# Altium schematic sheet LPCB218 - CHARGER INTERFACE.SchDoc
size A3; Address1: Factory 10; Address2: 9-13 Dingley Avenue, Dandeong, VICTORIA 3175, AUSTRALIA; DocumentNumber: 2; Revision: 1; SheetNumber: 2; SheetTotal: 14; Lockie__PCB_SUB_ASSEMBLY: Charger IF; Lockie__PCB_ASSEMBLY: Command Node; Lockie__LDL: LPCB218; Lockie__PCB_DESCRIPTION: Command Node
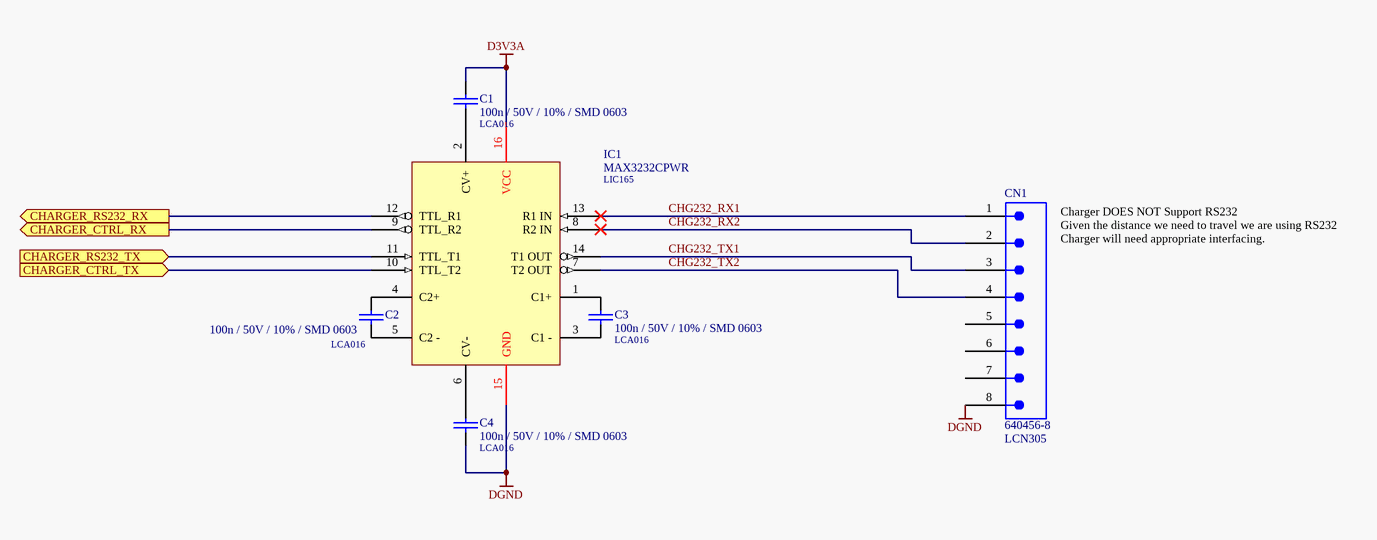
[diagram p0: LPCB218 - CHARGER INTERFACE.SchDoc]

## Parts
C1  100n / 50V / 10% / SMD 0603  LDL_NUMBER: LCA016  [LFP011__CC1608-0603-IPC7351_B]
C2  100n / 50V / 10% / SMD 0603  LDL_NUMBER: LCA016  [LFP011__CC1608-0603-IPC7351_B]
C3  100n / 50V / 10% / SMD 0603  LDL_NUMBER: LCA016  [LFP011__CC1608-0603-IPC7351_B]
C4  100n / 50V / 10% / SMD 0603  LDL_NUMBER: LCA016  [LFP011__CC1608-0603-IPC7351_B]
CN1  640456-8  LDL_NUMBER: LCN305  [640456-8]
IC1  MAX3232CPWR  LDL_NUMBER: LIC165  [LFP049__TSSOP-16]

## Ports
CHARGER_CTRL_RX (out), CHARGER_CTRL_TX (in), CHARGER_RS232_RX (out), CHARGER_RS232_TX (in)

## Nets
D3V3A: C1.1 IC1.16(VCC)
DGND: C4.2 CN1.8 IC1.15(GND)
CHARGER_CTRL_RX: IC1.9(TTL_R2) ; port CHARGER_CTRL_RX
CHARGER_CTRL_TX: IC1.10(TTL_T2) ; port CHARGER_CTRL_TX
CHARGER_RS232_RX: IC1.12(TTL_R1) ; port CHARGER_RS232_RX
CHARGER_RS232_TX: IC1.11(TTL_T1) ; port CHARGER_RS232_TX
CHG232_RX1: CN1.1 IC1.13(R1_IN)
CHG232_RX2: CN1.2 IC1.8(R2_IN)
CHG232_TX1: CN1.3 IC1.14(T1_OUT)
CHG232_TX2: CN1.4 IC1.7(T2_OUT)
NetC1_2: C1.2 IC1.2(CV+)
NetC2_1: C2.1 IC1.4(C2+)
NetC2_2: C2.2 IC1.5(C2_-)
NetC3_1: C3.1 IC1.1(C1+)
NetC3_2: C3.2 IC1.3(C1_-)
NetC4_1: C4.1 IC1.6(CV-)

Not connected (* = marked no-connect by the designer): CN1 5 6 7

## Notes on the sheet
- Charger DOES NOT Support RS232
  Given the distance we need to travel we are using RS232
  Charger will need appropriate interfacing.
- PCB COMPONENT DESCRIPTION
- LDL NUMBER
- Assembly Details
- Size
- Drawing File Name
- Revision
- http://rloop.org
- Scale
- A3
- Sheet Details
- N.T.S
- Sheet:
- Of:

## Library data of the parts
C1-C4 = 100n / 50V / 10% / SMD 0603: Capacitor, Ceramic Chip, 100nF, 50V, 10%, SMD 0603; FMEDA__OPERATING__VOLTAGE_MIN: 0; FMEDA__OPERATING__VOLTAGE_MAX: 3.3; FMEDA__OPERATING__TEMP_MIN: -20; FMEDA__OPERATING__TEMP_TYP: 27; FMEDA__OPERATING__TEMP_MAX: 50; FMEDA__CHANNEL: COM; Value: 100n; FMEDA__FUNCTION_IN_SYSTEM: *; FMEDA__OPERATING__VOLTAGE_TYP: 3.3
CN1 = 640456-8: Connector, Male Header, 8 Way; FMEDA__CHANNEL: COM; FMEDA__OPERATING__CURRENT_MAX: 0; FMEDA__OPERATING__TEMP_MAX: 50; FMEDA__OPERATING__TEMP_MIN: -20; FMEDA__OPERATING__TEMP_TYP: 27; FMEDA__OPERATING__VOLTAGE_MAX: 16; FMEDA__OPERATING__VOLTAGE_TYP: 12; FMEDA__FUNCTION_IN_SYSTEM: *; FMEDA__OPERATING__CURRENT_MIN: 0; FMEDA__OPERATING__CURRENT_TYP: 0; FMEDA__OPERATING__VOLTAGE_MIN: 0
IC1 = MAX3232CPWR: IC, RS232 Line Driver, 3.3V, SMD TSSOP16; FMEDA__OPERATING__TEMP_MAX: 50; FMEDA__OPERATING__TEMP_MIN: -20; FMEDA__OPERATING__TEMP_TYP: 27; FMEDA__CHANNEL: COM; FMEDA__OPERATING__VOLTAGE_MAX: 3.3; FMEDA__OPERATING__VOLTAGE_MIN: 0; FMEDA__FUNCTION_IN_SYSTEM: *; FMEDA__OPERATING__VOLTAGE_TYP: 3.3